# EAGLE design doser (EAGLE 5.11)
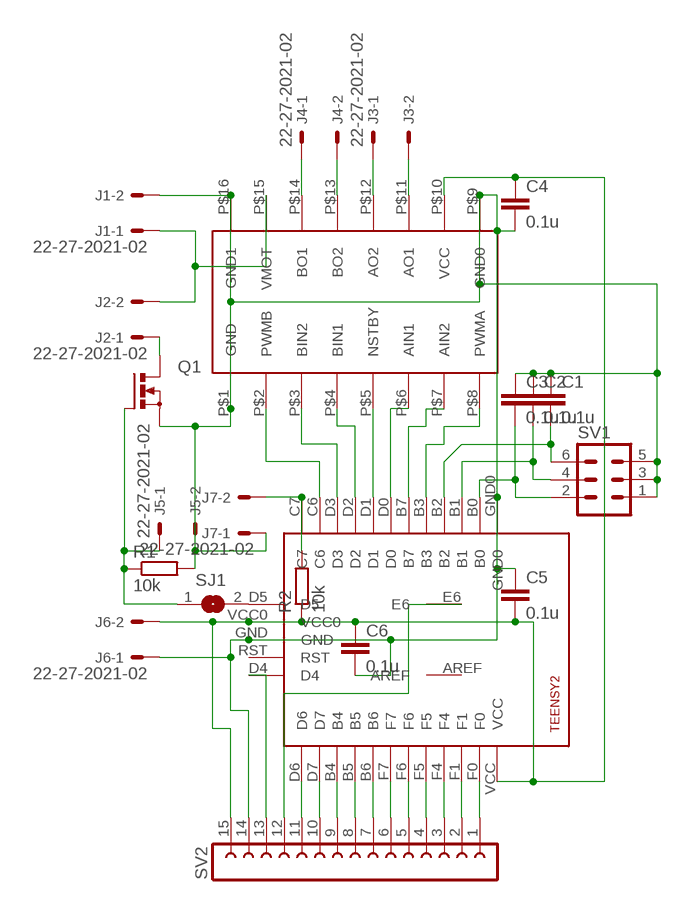
[diagram p0: schematic, sheet 1]

## Parts
C1  0.1u  C-EUC0603  [C0603]
C2  0.1u  C-EUC0603  [C0603]
C3  0.1u  C-EUC0603  [C0603]
C4  0.1u  C-EUC0603  [C0603]
C5  0.1u  C-EUC0603  [C0603]
C6  0.1u  C-EUC0603  [C0603]
J1  22-27-2021-02  [6410-02]
J2  22-27-2021-02  [6410-02]
J3  22-27-2021-02  [6410-02]
J4  22-27-2021-02  [6410-02]
J5  22-27-2021-02  [6410-02]
J6  22-27-2021-02  [6410-02]
J7  22-27-2021-02  [6410-02]
Q1  PMOSFET_NTO220BV  [TO220BV]
R1  10k  R-EU_R0603  [R0603]
R2  10k  R-EU_R0603  [R0603]
SJ1  SJ  [SJ]
SV1  MA03-2  [MA03-2]
SV2  FE15-1  [FE15]
U$1  TEENSY2  [TEENSY2]
U$2  POLTB6612  [POLTB6612]

## Nets
GND: C1.1 C2.1 C3.1 C4.2 C5.1 C6.2 J1.2 J5.2 J6.1 J7.1 Q1.S R1.2 SV1.1 SV1.3 SV1.5 SV2.14 U$1.GND U$1.GND0 U$2.P$1(GND) U$2.P$9(GND0) U$2.P$16(GND1)
N$1: U$1.D0 U$2.P$6(AIN1)
N$2: SV2.1 U$1.F0
N$3: U$1.B7 U$2.P$7(AIN2)
N$4: U$1.B3 U$2.P$8(PWMA)
N$5: U$1.D1 U$2.P$5(NSTBY)
N$6: U$1.D2 U$2.P$4(BIN1)
N$7: U$1.D3 U$2.P$3(BIN2)
N$8: U$1.C6 U$2.P$2(PWMB)
N$9: SV2.2 U$1.F1
N$10: C3.2 SV1.2 U$1.B0
N$11: C2.2 SV1.4 U$1.B1
N$12: C1.2 SV1.6 U$1.B2
N$13: SV2.3 U$1.F4
N$14: C4.1 C5.2 C6.1 J6.2 R2.1 SV2.15 U$1.VCC U$1.VCC0 U$2.P$10(VCC)
N$15: SV2.4 U$1.F5
N$16: J4.1 U$2.P$14(BO1)
N$17: J4.2 U$2.P$13(BO2)
N$18: J3.1 U$2.P$12(AO2)
N$19: J3.2 U$2.P$11(AO1)
N$20: J1.1 J2.2 U$2.P$15(VMOT)
N$21: J2.1 Q1.D
N$22: J5.1 Q1.G R1.1 SJ1.1
N$23: J7.2 R2.2 U$1.C7
N$24: SV2.5 U$1.F6
N$25: SV2.6 U$1.F7
N$26: SV2.7 U$1.B6
N$27: SV2.8 U$1.B5
N$28: SV2.9 U$1.B4
N$29: SV2.10 U$1.D7
N$30: SV2.11 U$1.D6
N$31: SV2.12 U$1.E6
N$32: SV2.13 U$1.D4
N$33: SJ1.2 U$1.D5
Unconnected: U$1.AREF U$1.RST

## Library data of the parts
C1-C6 = rcl:C-EU: CAPACITOR, European symbol
J1-J7 = con-molex:22-?-02: CONNECTOR wire to board 2.54 mm (.1 inch) pitch header; OC_FARNELL: unknown; OC_NEWARK: unknown
Q1 = transistor-power:PMOSFET_N: Power MOSFET N-Channel
R1 R2 = rcl:R-EU_: RESISTOR, European symbol
SJ1 = jumper:SJ: SMD solder JUMPER
SV1 = con-lstb:MA03-2: PIN HEADER; OC_FARNELL: unknown; OC_NEWARK: unknown
SV2 = con-lsta:FE15-1: FEMALE HEADER; OC_FARNELL: unknown; OC_NEWARK: unknown
U$1 = untitled:TEENSY2
U$2 = untitled:POLTB6612

## Board
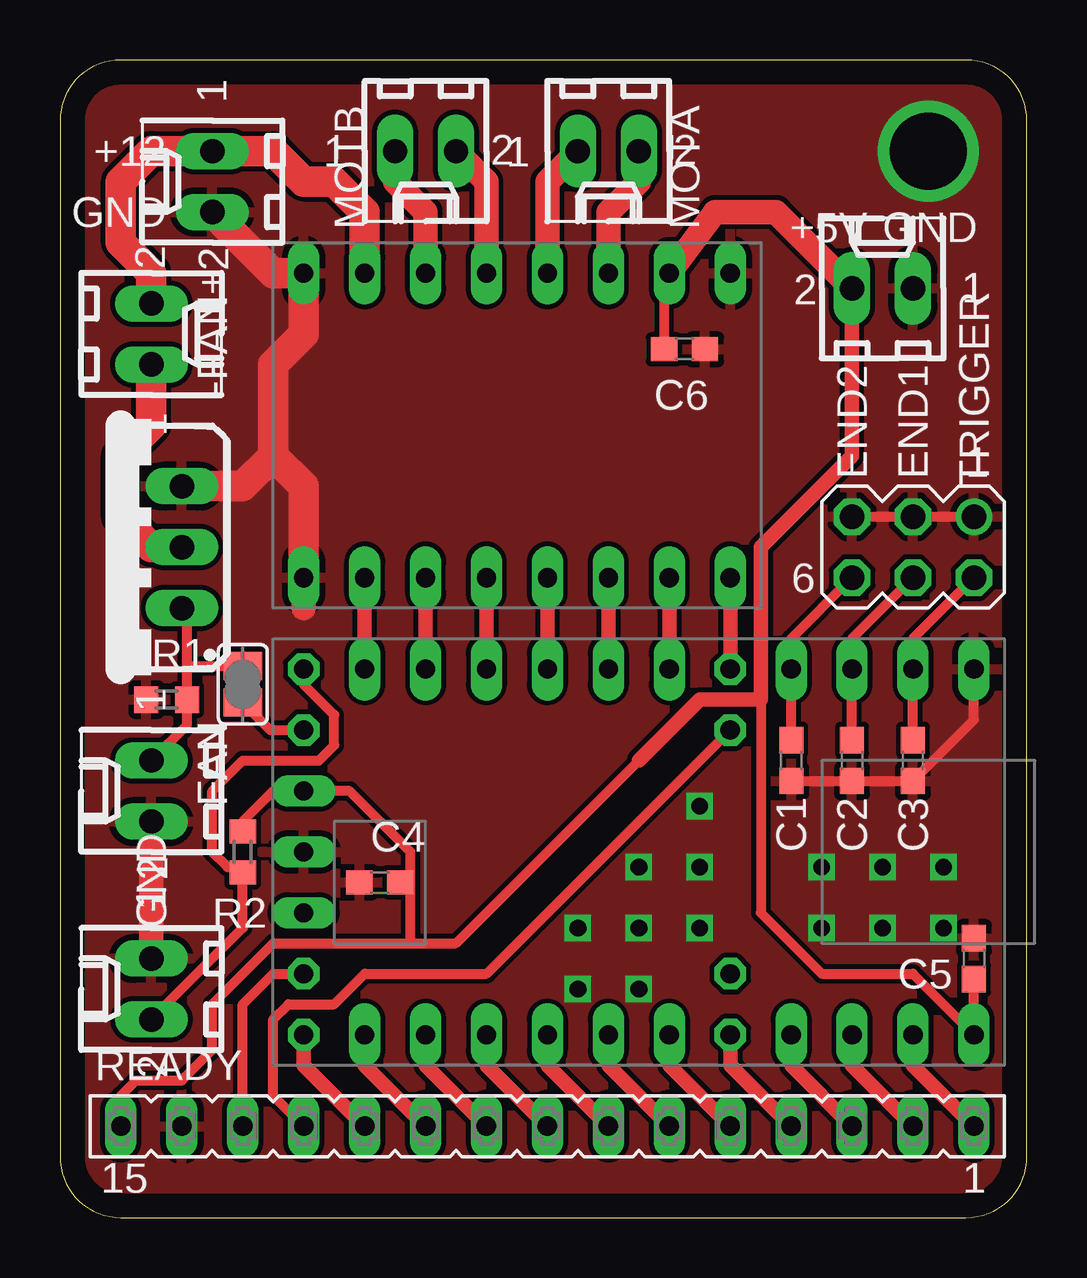
[diagram p1: board, top side]
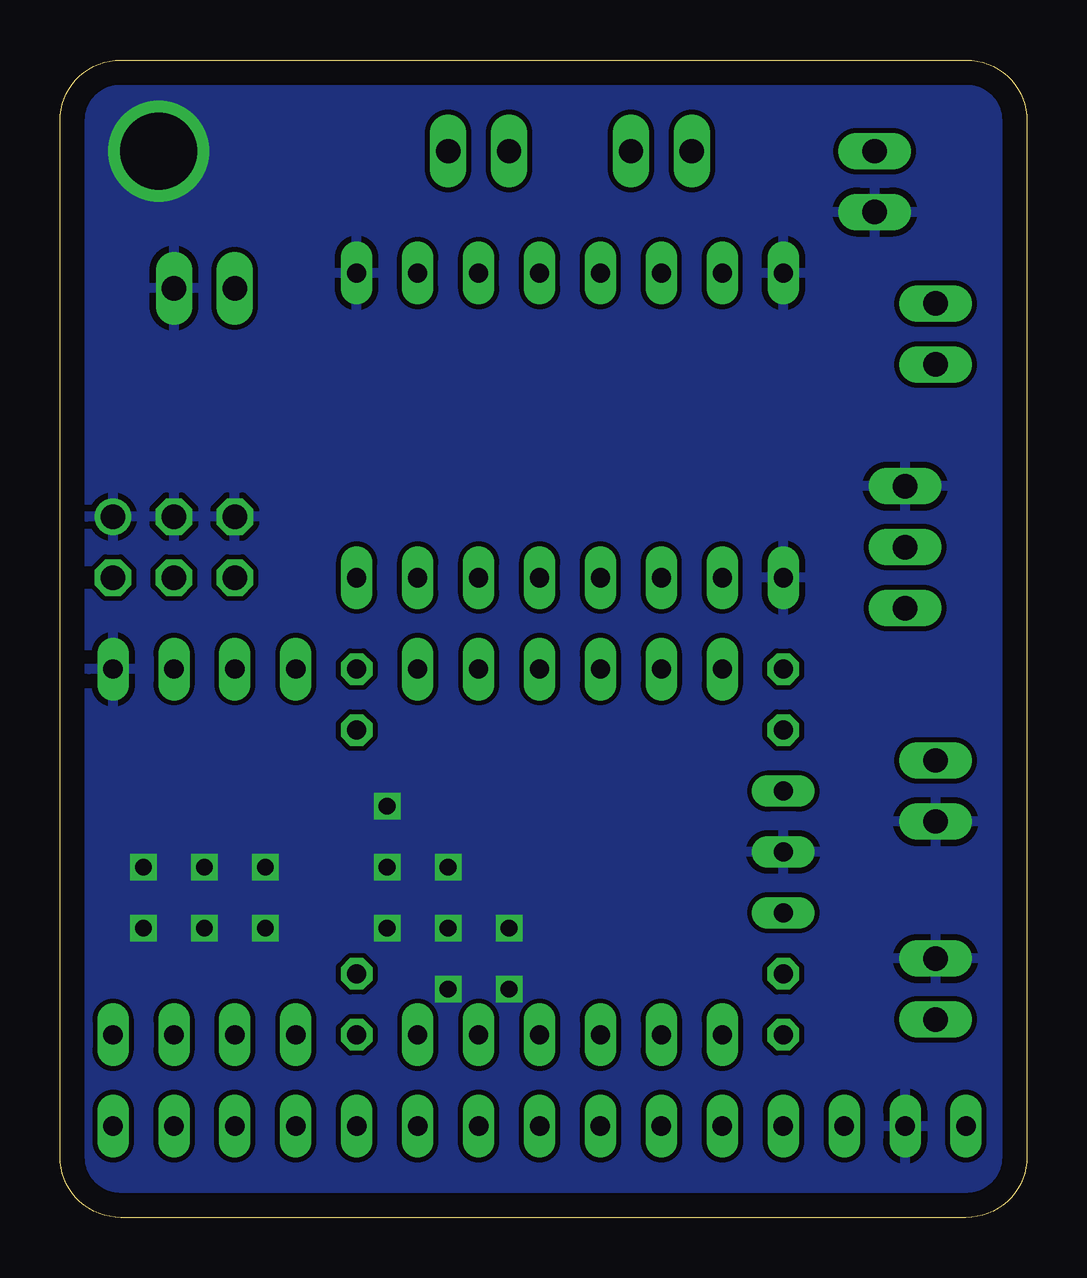
[diagram p2: board, bottom side, seen from below]

Size 40.31 x 48.25 mm. Coordinates in mm from the lower left corner, seen from the top.
Outline: 37.77,0 arc90 40.31,2.54 40.31,45.71 arc90 37.77,48.25 2.54,48.25 arc90 0,45.71 0,2.54 arc90 2.54,0 37.77,0
Copper layers (1*16): Top 0.035mm / dielectric 1.5mm / Bottom 0.035mm
Design rules "default": minimum track width 10mil, minimum drill 24mil, track to track 8mil, track to pad 8mil, pad to pad 8mil, via to via 8mil, smd to smd 8mil, copper to edge 40mil, drill to drill 8mil, minimum pad ring 10mil, minimum via ring 8mil, stop-mask expansion 4mil, vias tented up to drill 0mil, thermal gap 10mil

### Footprints (pad centres in the part's own frame; a part is rotated, then mirrored left to right if it is on the bottom)
C0603 = smd 1.1 x 1: 1 -0.85,0; 2 0.85,0
6410-02 = drill 1.016 long: 1 1.27,0; 2 -1.27,0
TO220BV = drill 1.016 long: D 0,-2.54; G -2.54,-2.54; S 2.54,-2.54
R0603 = smd 1 x 1.1: 1 -0.85,0; 2 0.85,0
SJ = smd 1.168 x 1.6: 1 -0.762,0; 2 0.762,0
MA03-2 = drill 1.016 round: 1 -2.54,-1.27 | drill 1.016 octagon: 2 -2.54,1.27; 3 0,-1.27; 4 0,1.27; 5 2.54,-1.27; 6 2.54,1.27
FE15 = drill 0.813 long: 1 -17.78,0; 2 -15.24,0; 3 -12.7,0; 4 -10.16,0; 5 -7.62,0; 6 -5.08,0; 7 -2.54,0; 8 0,0; 9 2.54,0; 10 5.08,0; 11 7.62,0; 12 10.16,0; 13 12.7,0; 14 15.24,0; 15 17.78,0
TEENSY2 = drill 0.8 octagon: AREF -3.81,5.08; B3 -3.81,-7.62; C7 13.97,-7.62; D4 13.97,5.08; D5 13.97,-5.08; D6 13.97,7.62; E6 -3.81,-5.08; F5 -3.81,7.62 | drill 0.8 long: B0 -11.43,-7.62; B1 -8.89,-7.62; B2 -6.35,-7.62; B4 8.89,7.62; B5 6.35,7.62; B6 3.81,7.62; B7 -1.27,-7.62; C6 11.43,-7.62; D0 1.27,-7.62; D1 3.81,-7.62; D2 6.35,-7.62; D3 8.89,-7.62; D7 11.43,7.62; F0 -11.43,7.62; F1 -8.89,7.62; F4 -6.35,7.62; F6 -1.27,7.62; F7 1.27,7.62; GND 13.97,0; GND0 -13.97,-7.62; RST 13.97,2.54; VCC -13.97,7.62; VCC0 13.97,-2.54
POLTB6612 = drill 0.8 long: P$1 -8.89,-6.35; P$2 -6.35,-6.35; P$3 -3.81,-6.35; P$4 -1.27,-6.35; P$5 1.27,-6.35; P$6 3.81,-6.35; P$7 6.35,-6.35; P$8 8.89,-6.35; P$9 8.89,6.35; P$10 6.35,6.35; P$11 3.81,6.35; P$12 1.27,6.35; P$13 -1.27,6.35; P$14 -3.81,6.35; P$15 -6.35,6.35; P$16 -8.89,6.35

### Placement (x,y rotation side)
C1  30.48,19.05 90 top
C2  33.02,19.05 90 top
C3  35.56,19.05 90 top
C4  13.34,13.97 180 top
C5  38.1,10.79 270 top
C6  26.04,36.2 0 top
J1  6.35,43.18 90 top
J2  3.81,36.83 270 top
J3  22.86,44.45 180 top
J4  15.24,44.45 180 top
J5  3.81,17.78 90 top
J6  34.29,38.73 0 top
J7  3.81,9.53 90 top
Q1  2.54,27.94 90 top
R1  4.45,21.59 180 top
R2  7.62,15.24 270 top
SJ1  7.62,22.23 270 top
SV1  35.56,27.94 180 top
SV2  20.32,3.81 180 top
U$1  24.13,15.24 180 top
U$2  19.05,33.02 0 top

### Tracks (layer width: path | path; a pad name or v marks a point on that pad's centre or on a via)
GND  (via drill 0.7, 3.2)
  Top 0.406: C1.1 C2.1 C3.1 38.1,20.74 U$1.GND0 | SV1.5 SV1.3 SV1.1 | J5.2 5.08,16.51
  Top 1.016: U$2.P$1 10.16,25.4 | J7.1 J5.2
  Top 1.27: J1.2 8.89,39.37 U$2.P$16 10.16,36.83 8.89,35.56 8.89,31.75 | Q1.S 7.62,30.48 8.89,31.75 | U$2.P$1 10.16,30.48 8.89,31.75
  other vias: 24.13,14.61 26.67,14.61 26.67,17.14 26.67,12.06 24.13,12.06 21.59,12.06 21.59,9.53 24.13,9.53 31.75,14.61 34.29,14.61 36.83,14.61 36.83,12.06 34.29,12.06 31.75,12.06 36.2,44.45
  pour Bottom: -1.27,49.53 41.91,49.53 41.91,-1.91 -3.81,-1.91 -3.81,45.09
  pour Top: 0.64,48.9 41.27,48.9 41.27,0 -0.64,0 -0.64,47.62
N$1
  Top 0.61: U$1.D0 U$2.P$6
N$2
  Top 0.61: U$1.F0 35.56,6.35 SV2.1
N$3
  Top 0.61: U$1.B7 U$2.P$7
N$4
  Top 0.61: U$1.B3 U$2.P$8
N$5
  Top 0.61: U$1.D1 U$2.P$5
N$6
  Top 0.61: U$1.D2 U$2.P$4
N$7
  Top 0.61: U$1.D3 U$2.P$3
N$8
  Top 0.61: U$1.C6 U$2.P$2
N$9
  Top 0.61: U$1.F1 33.02,6.35 SV2.2
N$10
  Top 0.406: C3.2 U$1.B0 35.56,24.13 SV1.2
N$11
  Top 0.406: C2.2 U$1.B1 33.02,24.13 SV1.4
N$12
  Top 0.406: C1.2 U$1.B2 30.48,24.13 SV1.6
N$13
  Top 0.61: U$1.F4 30.48,6.35 SV2.3
N$14
  Top 0.254: 14.61,13.97 C4.1 | U$2.P$10 25.18,39.16
  Top 0.406: 29.21,21.59 29.21,12.7 31.75,10.16 35.56,10.16 U$1.VCC C5.2 | SV2.15 2.54,5.08 3.17,5.71 5.08,5.71 6.35,6.99 6.35,8.89 8.89,11.43 14.61,11.43 | 14.61,11.43 16.51,11.43 24.45,19.37 | R2.1 7.62,16.51 8.89,17.78 U$1.VCC0 12.06,17.78 14.61,15.24 14.61,13.97 14.61,11.43 | 25.18,39.16 C6.1
  Top 0.61: J6.2 33.02,31.75 29.21,27.94 29.21,21.59 26.67,21.59 24.45,19.37 24.13,19.05
  Top 1.016: J6.2 29.84,41.91 27.3,41.91 U$2.P$10
N$15
  Top 0.61: U$1.F5 27.94,6.35 SV2.4
N$16
  Top 1.016: U$2.P$14 15.24,41.91 13.97,43.18 J4.1
N$17
  Top 1.016: U$2.P$13 17.78,43.18 J4.2
N$18
  Top 1.016: U$2.P$12 20.32,43.18 J3.1
N$19
  Top 1.016: U$2.P$11 22.86,41.91 24.13,43.18 J3.2
N$20
  Top 1.27: U$2.P$15 12.7,41.91 11.43,43.18 10.16,43.18 8.89,44.45 J1.1 3.81,44.45 2.54,43.18 2.54,40.64 3.81,39.37 J2.2
N$21
  Top 1.27: J2.1 3.81,33.02 2.54,31.75 2.54,29.21 3.81,27.94 Q1.D
N$22
  Top 0.406: 5.29,22.86 R1.1 5.29,20.54 J5.1 | 5.29,22.86 5.29,25.18 Q1.G | SJ1.1 5.42,22.99 5.29,22.86
N$23
  Top 0.406: U$1.C7 10.16,22.23 11.43,20.95 11.43,19.68 10.79,19.05 7.62,19.05 6.35,17.78 6.35,15.24 6.99,14.61 7.41,14.61 R2.2 7.62,12.06 J7.2
N$24
  Top 0.61: U$1.F6 25.4,6.35 SV2.5
N$25
  Top 0.61: U$1.F7 22.86,6.35 SV2.6
N$26
  Top 0.61: U$1.B6 20.32,6.35 SV2.7
N$27
  Top 0.61: U$1.B5 17.78,6.35 SV2.8
N$28
  Top 0.61: U$1.B4 15.24,6.35 SV2.9
N$29
  Top 0.61: U$1.D7 12.7,6.35 SV2.10
N$30
  Top 0.61: U$1.D6 10.16,6.35 SV2.11
N$31
  Top 0.406: SV2.12 8.89,5.08 8.89,8.26 9.53,8.89 11.43,8.89 12.7,10.16 17.78,10.16 U$1.E6
N$32
  Top 0.406: SV2.13 7.62,8.89 8.89,10.16 U$1.D4
N$33
  Top 0.406: U$1.D5 8.76,20.32 SJ1.2

### Text on the board
tNames: MOTB | MOTA | +12 | GND | +5V | GND | END2 | END1 | -FAN+ | TRIGGER | FAN | GND | READY